# Altium schematic sheet PAGE08 System Power.SchDoc
size 297 x 209 mm; SheetNumber: 8; SheetTotal: 9
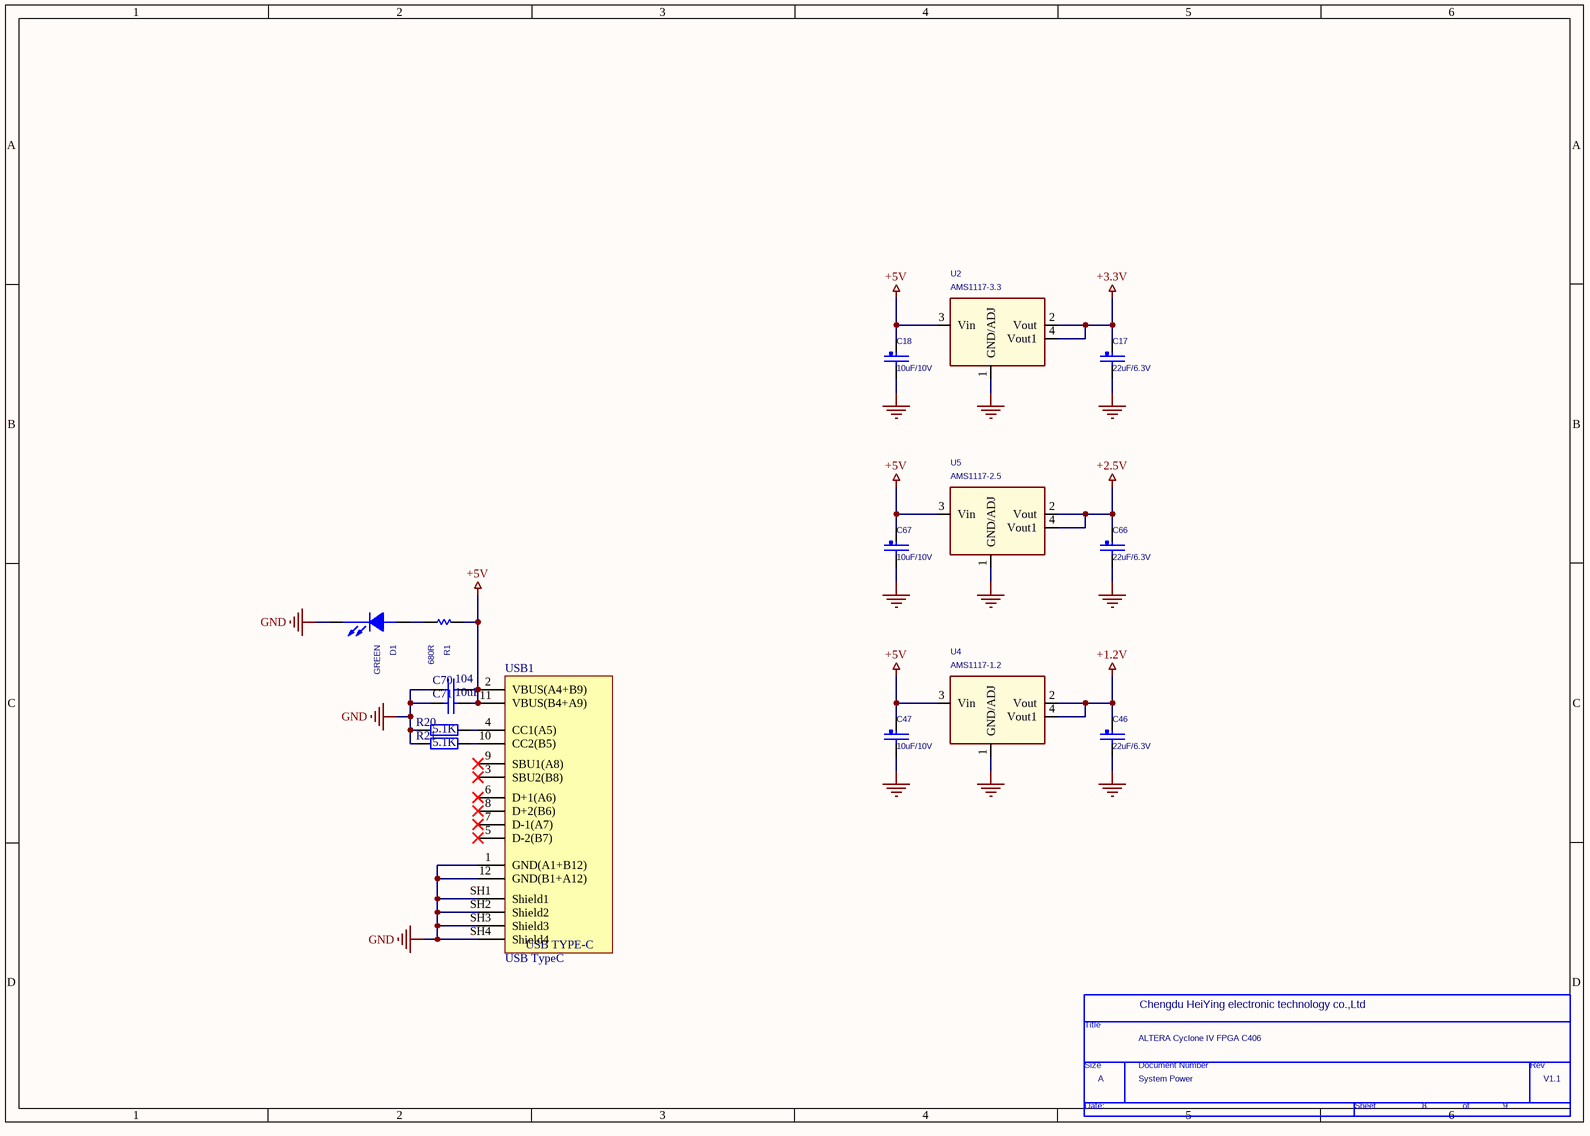
[diagram p0: PAGE08 System Power.SchDoc]

## Parts
*  Page Count: 9  Page Number: 8  Page Size: A  Title: ALTERA Cyclone IV FPGA C406  RevCode: V1.1  Doc: System Power  (hidden comment: TitleBlock0)  (graphical)
C17  22uF/6.3V  [C0805]
C18  10uF/10V  [C0805]
C46  22uF/6.3V  [C0805]
C47  10uF/10V  [C0805]
C66  22uF/6.3V  [C0805]
C67  10uF/10V  [C0805]
C70  104  [C 0603]
C71  10uF  [C 0603]
D1  GREEN  [Q0603]
R1  680R  [R 0603]
R20  5.1K  [R 0603]
R21  5.1K  [R 0603]
U2  AMS1117-3.3  [SOT-223]
U4  AMS1117-1.2  [SOT-223]
U5  AMS1117-2.5  [SOT-223]
USB1  USB TypeC  [USB2.0-TYPE-C-16P]

## Nets
+1.2V: C46.1 U4.2(Vout) U4.4(Vout1)
+2.5V: C66.1 U5.2(Vout) U5.4(Vout1)
+3.3V: C17.1 U2.2(Vout) U2.4(Vout1)
+5V: C18.1 C47.1 C67.1 C70.1 C71.1 R1.1 U2.3(Vin) U4.3(Vin) U5.3(Vin) USB1.2(VBUS(A4+B9)) USB1.11(VBUS(B4+A9))
GND: C17.2 C18.2 C46.2 C47.2 C66.2 C67.2 C70.2 C71.2 D1.2(CATHODE) R20.2 R21.2 U2.1(GND/ADJ) U4.1(GND/ADJ) U5.1(GND/ADJ) USB1.1(GND(A1+B12)) USB1.12(GND(B1+A12)) USB1.SH1(Shield1) USB1.SH2(Shield2) USB1.SH3(Shield3) USB1.SH4(Shield4)
NetD1_1: D1.1(ANODE) R1.2
NetR20_1: R20.1 USB1.4(CC1(A5))
NetR21_1: R21.1 USB1.10(CC2(B5))

Not connected (* = marked no-connect by the designer): USB1 3(SBU2(B8))* 5(D-2(B7))* 6(D+1(A6))* 7(D-1(A7))* 8(D+2(B6))* 9(SBU1(A8))*

## Notes on the sheet
- Chengdu HeiYing electronic technology co.,Ltd
- (in symbol TitleBlock0) Title; Size; Document Number; Rev; Date:; Sheet; of
- (in symbol USB Type-C) USB TYPE-C

## Library data of the parts
C17 C46 = CAP_NP: Capacitor, 10u, 0805, X6S, 10%, 10V; FPLIST: CC0201,CC0201_HD,CC0201_3PIN,0201_CC; CAD_APPROVED: Yes; MFG_PN01: GRM31CR71A106KA01L; MFG_NAME01: MURATA; AGILE_PN: 150-75429; HEIGHT: 0.33MM; ROHS: Yes; Tolerance: 10%
C18 C47 = CAP_NP: CAP CER 22UF 16V 10%; AGILE_PN: 150-75429; MFG_NAME01: Murata; MFG_PN01: GRM033R60J104KE19D; CAD_APPROVED: Yes; FPLIST: CC0201,CC0201_HD,CC0201_3PIN,0201_CC; Tolerance: 10%; ROHS: Yes; HEIGHT: 0.33MM
C66 = CAP_NP: Capacitor, 10u, 0805, X6S, 10%, 10V; AGILE_PN: 150-75429; MFG_NAME01: MURATA; MFG_PN01: GRM31CR71A106KA01L; CAD_APPROVED: Yes; FPLIST: CC0201,CC0201_HD,CC0201_3PIN,0201_CC; Tolerance: 10%; ROHS: Yes; HEIGHT: 0.33MM
C67 = CAP_NP: CAP CER 22UF 16V 10%; FPLIST: CC0201,CC0201_HD,CC0201_3PIN,0201_CC; CAD_APPROVED: Yes; MFG_PN01: GRM033R60J104KE19D; MFG_NAME01: Murata; AGILE_PN: 150-75429; HEIGHT: 0.33MM; ROHS: Yes; Tolerance: 10%
C70 C71 = C-0603-SMD
D1 = LED: ROOM: POWER
R1 = SMALL R1
R20 R21 = R: 电阻; BOM名称: 贴片电阻; 版权归属: 正点原子; 学习资源: www.openedv.com; Parameter: 电阻
U2 U4 U5 = AMS1117
USB1 = USB Type-C: 12P TypeC 母座
* = TitleBlock0: Page Create Date: March  8, 1995